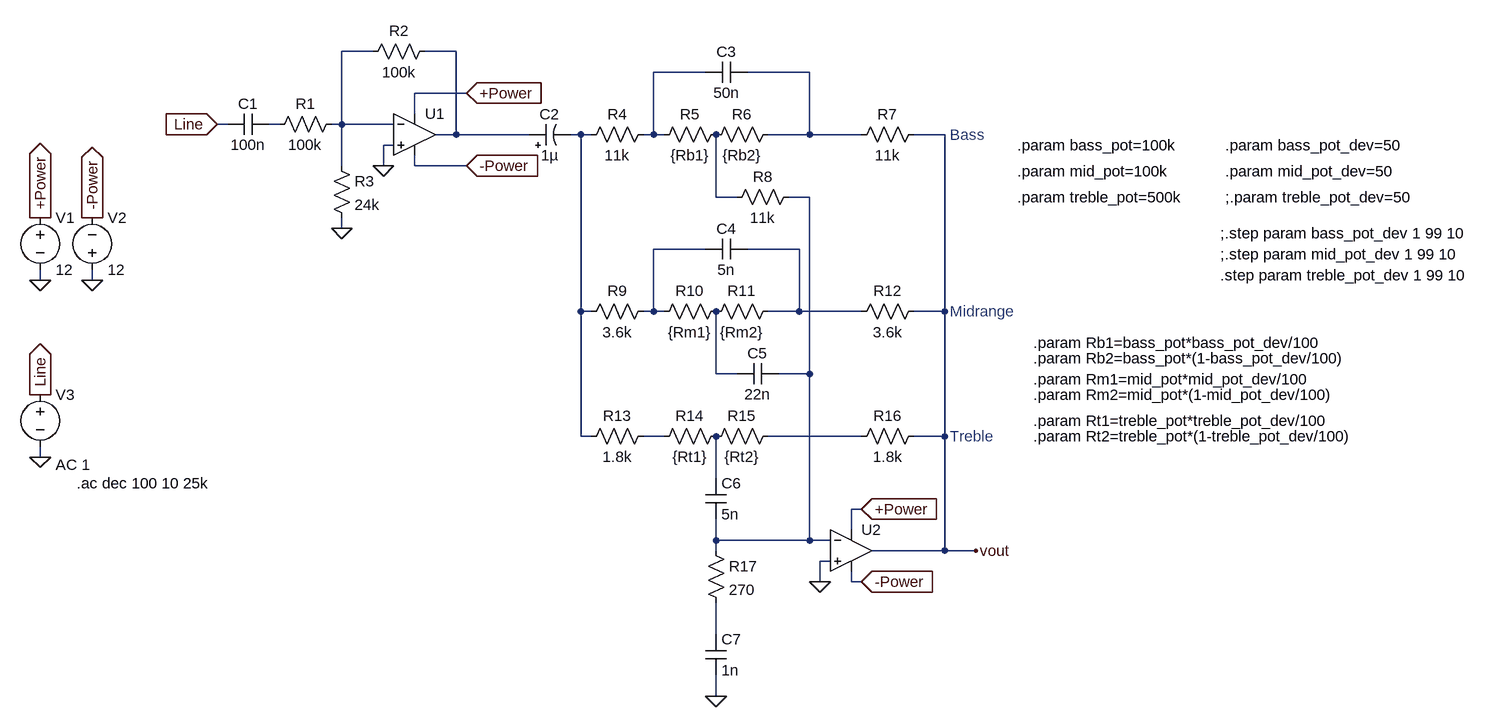
[diagram p0: schematic Tone Control.asc]
Tone Control.asc, the LTspice schematic file:
Version 4.1
SHEET 1 1916 996
WIRE 176 -16 128 -16
WIRE 304 -16 256 -16
WIRE 688 16 608 16
WIRE 848 16 752 16
WIRE 320 48 240 48
WIRE 240 80 240 48
WIRE -48 96 -64 96
WIRE 32 96 16 96
WIRE 128 96 128 -16
WIRE 128 96 112 96
WIRE 208 96 128 96
WIRE 304 112 304 -16
WIRE 304 112 272 112
WIRE 416 112 304 112
WIRE 496 112 480 112
WIRE 512 112 496 112
WIRE 608 112 608 16
WIRE 608 112 592 112
WIRE 624 112 608 112
WIRE 848 112 848 16
WIRE 848 112 784 112
WIRE 928 112 848 112
WIRE 1056 112 1008 112
WIRE 208 128 192 128
WIRE 128 160 128 96
WIRE 192 160 192 128
WIRE 240 160 240 144
WIRE 320 160 240 160
WIRE 704 208 704 112
WIRE 736 208 704 208
WIRE 848 208 816 208
WIRE 128 256 128 240
WIRE 688 288 608 288
WIRE 832 288 752 288
WIRE -336 336 -336 320
WIRE -256 336 -256 320
WIRE 496 384 496 112
WIRE 512 384 496 384
WIRE 608 384 608 288
WIRE 608 384 592 384
WIRE 624 384 608 384
WIRE 832 384 832 288
WIRE 832 384 784 384
WIRE 928 384 832 384
WIRE 1056 384 1056 112
WIRE 1056 384 1008 384
WIRE 704 480 704 384
WIRE 736 480 704 480
WIRE 848 480 848 208
WIRE 848 480 800 480
WIRE 496 576 496 384
WIRE 512 576 496 576
WIRE 624 576 592 576
WIRE 928 576 784 576
WIRE 1056 576 1056 384
WIRE 1056 576 1008 576
WIRE -336 608 -336 592
WIRE 704 640 704 576
WIRE 928 688 912 688
WIRE 912 720 912 688
WIRE 704 736 704 704
WIRE 848 736 848 480
WIRE 848 736 704 736
WIRE 880 736 848 736
WIRE 704 752 704 736
WIRE 1056 752 1056 576
WIRE 1056 752 944 752
WIRE 1104 752 1056 752
WIRE 880 768 864 768
WIRE 864 800 864 768
WIRE 912 800 912 784
WIRE 928 800 912 800
WIRE 704 880 704 832
WIRE 704 976 704 944
FLAG 320 48 +Power
IOPIN 320 48 In
FLAG 320 160 -Power
IOPIN 320 160 In
FLAG 128 256 0
FLAG 192 160 0
FLAG -64 96 Line
IOPIN -64 96 In
FLAG -336 240 +Power
IOPIN -336 240 Out
FLAG -256 240 -Power
IOPIN -256 240 Out
FLAG -336 512 Line
IOPIN -336 512 Out
FLAG -336 336 0
FLAG -256 336 0
FLAG -336 608 0
FLAG 704 976 0
FLAG 928 688 +Power
IOPIN 928 688 In
FLAG 928 800 -Power
IOPIN 928 800 In
FLAG 864 800 0
FLAG 1104 752 vout
SYMBOL cap 16 80 R90
WINDOW 0 0 32 VBottom 2
WINDOW 3 32 32 VTop 2
SYMATTR InstName C1
SYMATTR Value 100n
SYMBOL res 128 80 R90
WINDOW 0 0 56 VBottom 2
WINDOW 3 32 56 VTop 2
SYMATTR InstName R1
SYMATTR Value 100k
SYMBOL OpAmps\\UniversalOpAmp 240 112 R0
SYMATTR InstName U1
SYMBOL res 272 -32 R90
WINDOW 0 0 56 VBottom 2
WINDOW 3 32 56 VTop 2
SYMATTR InstName R2
SYMATTR Value 100k
SYMBOL res 112 144 R0
SYMATTR InstName R3
SYMATTR Value 24k
SYMBOL polcap 416 128 R270
WINDOW 0 32 32 VTop 2
WINDOW 3 0 32 VBottom 2
SYMATTR InstName C2
SYMATTR Value 1µ
SYMBOL voltage -336 224 R0
WINDOW 123 0 0 Left 0
WINDOW 39 0 0 Left 0
SYMATTR InstName V1
SYMATTR Value 12
SYMBOL voltage -256 336 M180
WINDOW 0 24 96 Left 2
WINDOW 3 24 16 Left 2
WINDOW 123 0 0 Left 0
WINDOW 39 0 0 Left 0
SYMATTR InstName V2
SYMATTR Value 12
SYMBOL voltage -336 496 R0
WINDOW 123 24 124 Left 2
WINDOW 39 0 0 Left 0
SYMATTR Value2 AC 1
SYMATTR InstName V3
SYMATTR Value ""
SYMBOL res 608 96 R90
WINDOW 0 0 56 VBottom 2
WINDOW 3 32 56 VTop 2
SYMATTR InstName R4
SYMATTR Value 11k
SYMBOL res 1024 96 R90
WINDOW 0 0 56 VBottom 2
WINDOW 3 32 56 VTop 2
SYMATTR InstName R7
SYMATTR Value 11k
SYMBOL res 832 192 R90
WINDOW 0 0 56 VBottom 2
WINDOW 3 32 56 VTop 2
SYMATTR InstName R8
SYMATTR Value 11k
SYMBOL res 608 368 R90
WINDOW 0 0 56 VBottom 2
WINDOW 3 32 56 VTop 2
SYMATTR InstName R9
SYMATTR Value 3.6k
SYMBOL res 1024 368 R90
WINDOW 0 0 56 VBottom 2
WINDOW 3 32 56 VTop 2
SYMATTR InstName R12
SYMATTR Value 3.6k
SYMBOL res 608 560 R90
WINDOW 0 0 56 VBottom 2
WINDOW 3 32 56 VTop 2
SYMATTR InstName R13
SYMATTR Value 1.8k
SYMBOL res 1024 560 R90
WINDOW 0 0 56 VBottom 2
WINDOW 3 32 56 VTop 2
SYMATTR InstName R16
SYMATTR Value 1.8k
SYMBOL cap 800 464 R90
WINDOW 0 0 32 VBottom 2
WINDOW 3 32 32 VTop 2
SYMATTR InstName C5
SYMATTR Value 22n
SYMBOL cap 752 272 R90
WINDOW 0 0 32 VBottom 2
WINDOW 3 32 32 VTop 2
SYMATTR InstName C4
SYMATTR Value 5n
SYMBOL cap 752 0 R90
WINDOW 0 0 32 VBottom 2
WINDOW 3 32 32 VTop 2
SYMATTR InstName C3
SYMATTR Value 50n
SYMBOL cap 688 640 R0
SYMATTR InstName C6
SYMATTR Value 5n
SYMBOL res 688 736 R0
SYMATTR InstName R17
SYMATTR Value 270
SYMBOL cap 688 880 R0
SYMATTR InstName C7
SYMATTR Value 1n
SYMBOL OpAmps\\UniversalOpAmp 912 752 R0
SYMATTR InstName U2
SYMBOL res 720 96 R90
WINDOW 0 0 56 VBottom 2
WINDOW 3 32 56 VTop 2
SYMATTR InstName R5
SYMATTR Value {Rb1}
SYMBOL res 800 96 R90
WINDOW 0 0 56 VBottom 2
WINDOW 3 32 56 VTop 2
SYMATTR InstName R6
SYMATTR Value {Rb2}
SYMBOL res 720 368 R90
WINDOW 0 0 56 VBottom 2
WINDOW 3 32 56 VTop 2
SYMATTR InstName R10
SYMATTR Value {Rm1}
SYMBOL res 800 368 R90
WINDOW 0 0 56 VBottom 2
WINDOW 3 32 56 VTop 2
SYMATTR InstName R11
SYMATTR Value {Rm2}
SYMBOL res 720 560 R90
WINDOW 0 0 56 VBottom 2
WINDOW 3 32 56 VTop 2
SYMATTR InstName R14
SYMATTR Value {Rt1}
SYMBOL res 800 560 R90
WINDOW 0 0 56 VBottom 2
WINDOW 3 32 56 VTop 2
SYMATTR InstName R15
SYMATTR Value {Rt2}
TEXT -280 648 Left 2 !.ac dec 100 10 25k
TEXT 1168 128 Left 2 !.param bass_pot=100k
TEXT 1168 168 Left 2 !.param mid_pot=100k
TEXT 1168 208 Left 2 !.param treble_pot=500k
TEXT 1488 128 Left 2 !.param bass_pot_dev=50
TEXT 1488 168 Left 2 !.param mid_pot_dev=50
TEXT 1488 208 Left 2 !;.param treble_pot_dev=50
TEXT 1064 112 Left 2 ;Bass
TEXT 1064 384 Left 2 ;Midrange
TEXT 1064 576 Left 2 ;Treble
TEXT 1480 328 Left 2 !.step param treble_pot_dev 1 99 10
TEXT 1480 296 Left 2 !;.step param mid_pot_dev 1 99 10
TEXT 1480 264 Left 2 !;.step param bass_pot_dev 1 99 10
TEXT 1192 456 Left 2 !.param Rb2=bass_pot*(1-bass_pot_dev/100)
TEXT 1192 432 Left 2 !.param Rb1=bass_pot*bass_pot_dev/100
TEXT 1192 512 Left 2 !.param Rm2=mid_pot*(1-mid_pot_dev/100)
TEXT 1192 488 Left 2 !.param Rm1=mid_pot*mid_pot_dev/100
TEXT 1192 576 Left 2 !.param Rt2=treble_pot*(1-treble_pot_dev/100)
TEXT 1192 552 Left 2 !.param Rt1=treble_pot*treble_pot_dev/100

The netlist it stands for:
* Tone Control.asc
C1 N005 Line 100n
R1 N001 N005 100k
X§U1 0 N001 +Power -Power N002 level1 Avol=1Meg GBW=10Meg Vos=0 En=0 Enk=0 In=0 Ink=0 Rin=500Meg  ; pins In+ In- V+ V- OUT
R2 N002 N001 100k
R3 N001 0 24k
C2 N002 N006 1µ
V1 +Power 0 12
V2 0 -Power 12
V3 Line 0 AC 1
R4 N003 N006 11k
R7 vout N004 11k
R8 N008 N007 11k
R9 N009 N006 3.6k
R12 vout N010 3.6k
R13 N012 N006 1.8k
R16 vout N013 1.8k
C5 N008 N011 22n
C4 N010 N009 5n
C3 N004 N003 50n
C6 N014 N008 5n
R17 N008 N015 270
C7 N015 0 1n
X§U2 0 N008 +Power -Power vout level1 Avol=1Meg GBW=10Meg Vos=0 En=0 Enk=0 In=0 Ink=0 Rin=500Meg  ; pins In+ In- V+ V- OUT
R5 N007 N003 {Rb1}
R6 N004 N007 {Rb2}
R10 N011 N009 {Rm1}
R11 N010 N011 {Rm2}
R14 N014 N012 {Rt1}
R15 N013 N014 {Rt2}
.ac dec 100 10 25k
.param bass_pot=100k
.param mid_pot=100k
.param treble_pot=500k
.param bass_pot_dev=50
.param mid_pot_dev=50
;.param treble_pot_dev=50
* Bass
* Midrange
* Treble
.step param treble_pot_dev 1 99 10
;.step param mid_pot_dev 1 99 10
;.step param bass_pot_dev 1 99 10
.param Rb2=bass_pot*(1-bass_pot_dev/100)
.param Rb1=bass_pot*bass_pot_dev/100
.param Rm2=mid_pot*(1-mid_pot_dev/100)
.param Rm1=mid_pot*mid_pot_dev/100
.param Rt2=treble_pot*(1-treble_pot_dev/100)
.param Rt1=treble_pot*treble_pot_dev/100
.lib UniversalOpAmp1.lib
.backanno
.end